# EAGLE design bike-computer (EAGLE 9.5.2)
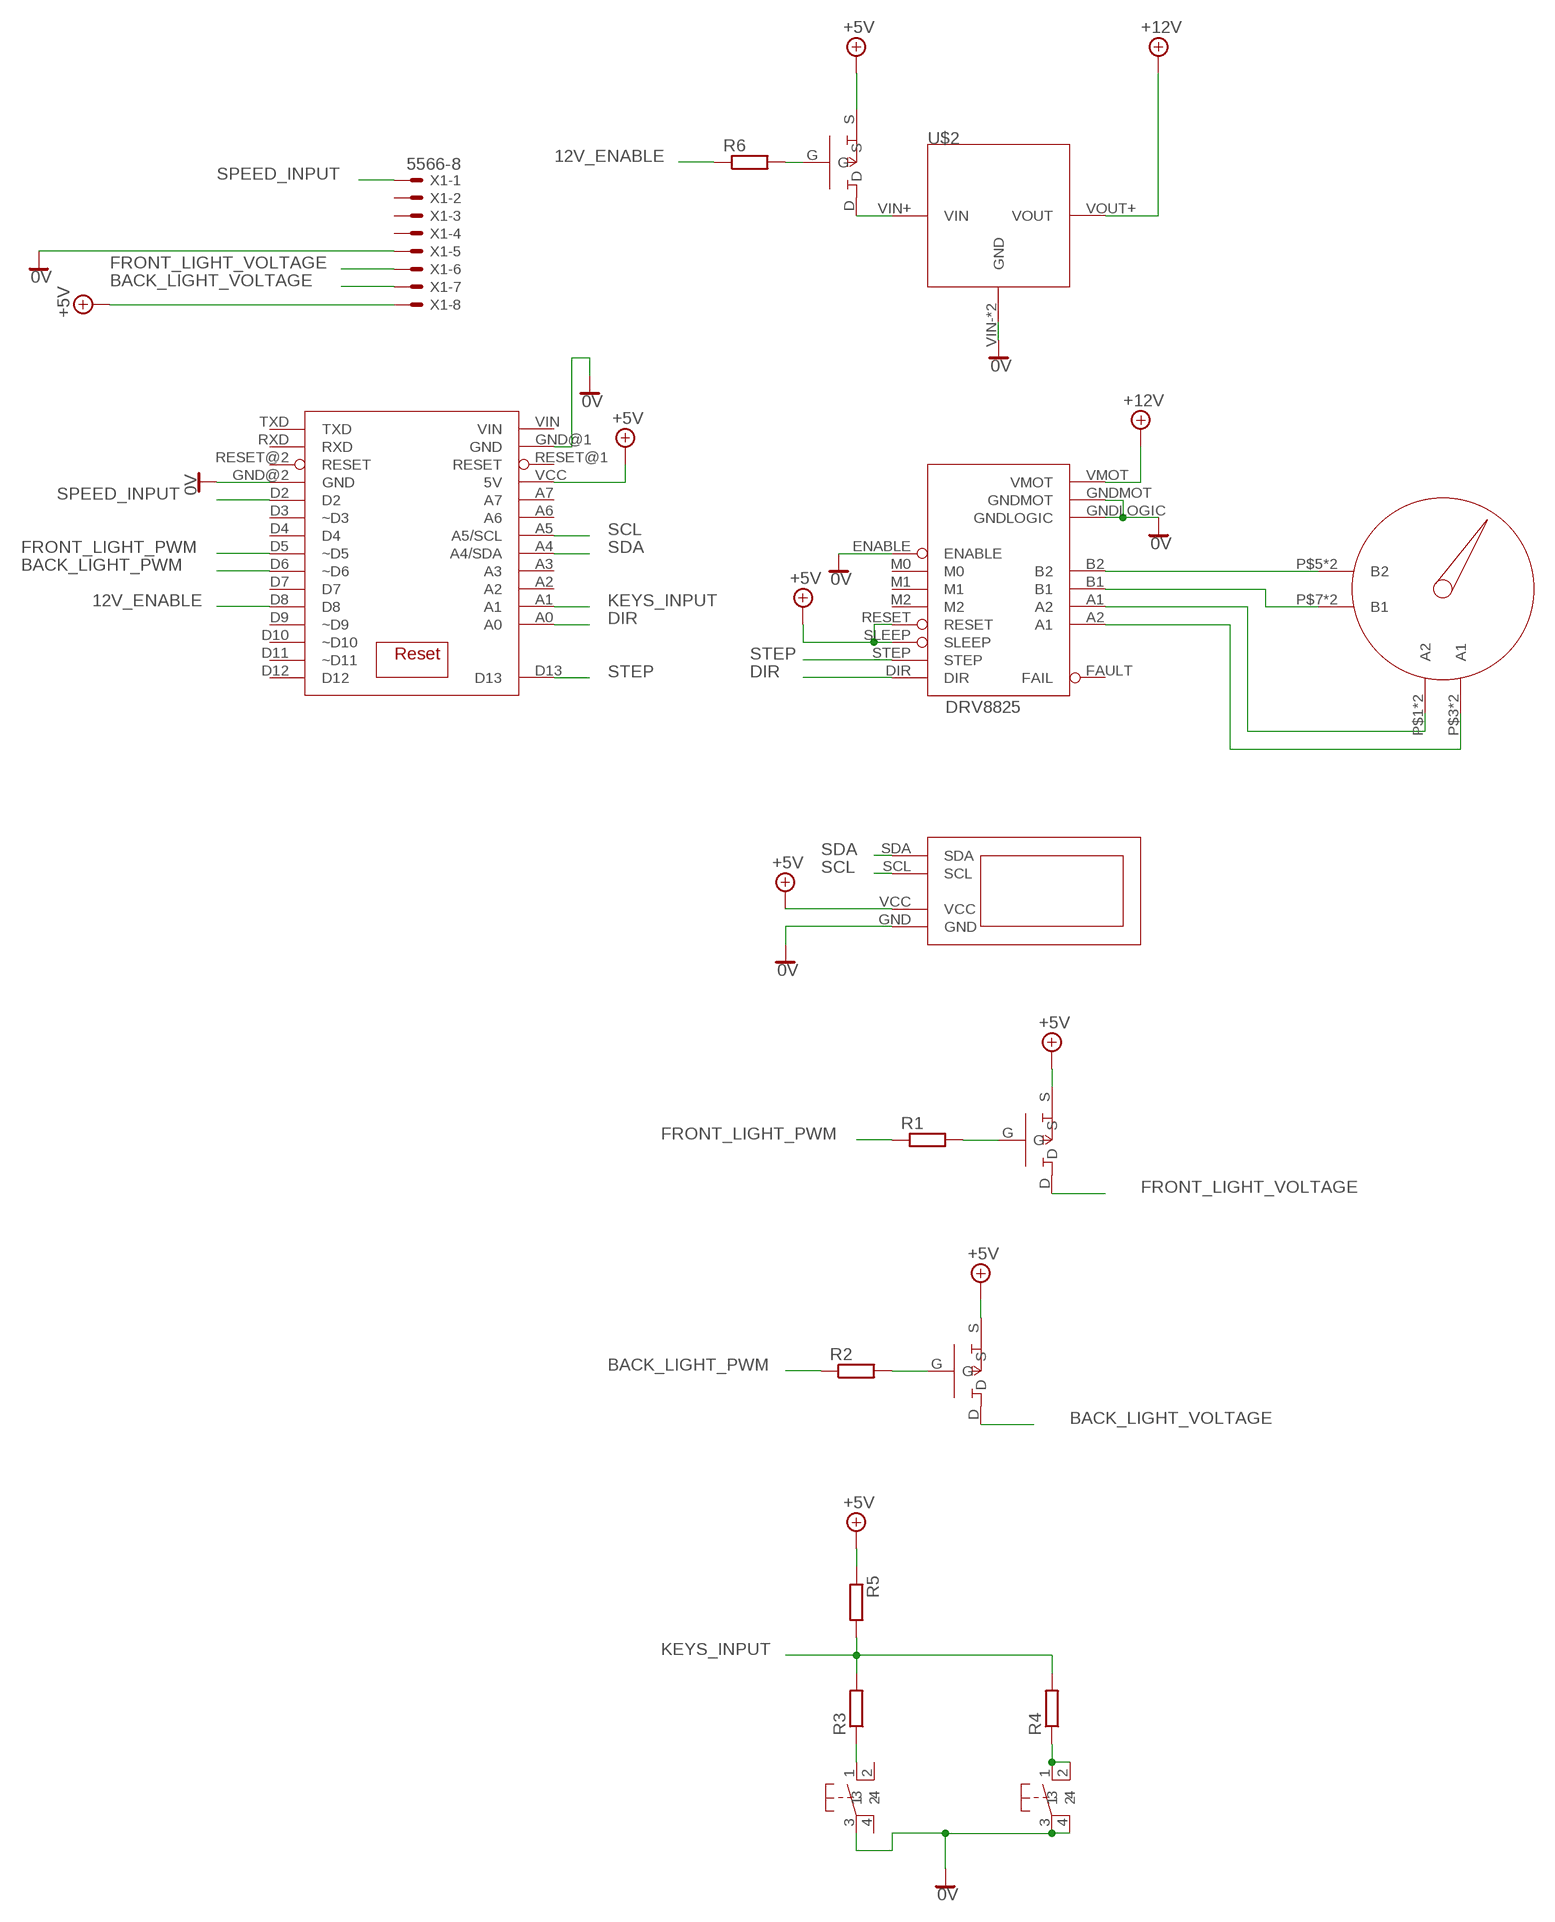
[diagram p0: schematic, sheet 1]

## Parts
DRV8825  DRV8825_BOARD  [DRV8255_BOARD]
R1  R-EU_0617/17  [0617/17]
R2  R-EU_0207/15  [0207/15]
R3  R-EU_0207/12  [0207/12]
R4  R-EU_0204/5  [0204/5]
R5  R-EU_0204/5  [0204/5]
R6  R-EU_0207/15  [0207/15]
U$1  STEPPER_GAUGE  [STEPPER_GAUGE]
U$2  STEP_UP_REG  [STEP_UP_REG]
U$3  OLED_0.9  [OLED_0.9]
U$4  BS250  [TO92(2.54)]
U$5  BS250  [TO92(2.54)]
U$6  BS250  [TO92(2.54)]
U$7  ARDUINO_PRO_MINI  [ARDUINO_PRO_MINI]
U$8  MICRO_SWITCH  [MICRO_SWITCH]
U$9  MICRO_SWITCH  [MICRO_SWITCH]
X1  5566-8  [5566-8]

## Nets
0V: DRV8825.ENABLE DRV8825.GNDLOGIC DRV8825.GNDMOT U$2.VIN-(GND) U$2.VOUT-(GND) U$3.GND U$7.GND@1(GND) U$7.GND@2(GND) U$8.3 U$9.3 U$9.4 X1.5
12V_ENABLE: R6.1 U$7.D8
+5V: DRV8825.RESET DRV8825.SLEEP R5.1 U$3.VCC U$4.S U$5.S U$6.S U$7.VCC(5V) X1.8
+12V: DRV8825.VMOT U$2.VOUT+(VOUT)
BACK_LIGHT_PWM: R2.1 U$7.D6(~D6)
BACK_LIGHT_VOLTAGE: U$5.D X1.7
DIR: DRV8825.DIR U$7.A0
FRONT_LIGHT_PWM: R1.1 U$7.D5(~D5)
FRONT_LIGHT_VOLTAGE: U$4.D X1.6
KEYS_INPUT: R3.2 R4.2 R5.2 U$7.A1
N$1: DRV8825.B2 U$1.P$5(B2) U$1.P$6(B2)
N$2: DRV8825.B1 U$1.P$7(B1) U$1.P$8(B1)
N$3: DRV8825.A1(A2) U$1.P$1(A2) U$1.P$2(A2)
N$4: DRV8825.A2(A1) U$1.P$3(A1) U$1.P$4(A1)
N$5: R1.2 U$4.G
N$6: R6.2 U$6.G
N$7: U$2.VIN+(VIN) U$6.D
N$8: R2.2 U$5.G
N$10: R3.1 U$8.1
N$11: R4.1 U$9.1 U$9.2
SCL: U$3.SCL U$7.A5(A5/SCL)
SDA: U$3.SDA U$7.A4(A4/SDA)
SPEED_INPUT: U$7.D2 X1.1
STEP: DRV8825.STEP U$7.D13
Unconnected: DRV8825.FAULT(FAIL) DRV8825.M0 DRV8825.M1 DRV8825.M2 U$7.A2 U$7.A3 U$7.A6 U$7.A7 U$7.D3(~D3) U$7.D4 U$7.D7 U$7.D9(~D9) U$7.D10(~D10) U$7.D11(~D11) U$7.D12 U$7.RESET@1(RESET) U$7.RESET@2(RESET) U$7.RXD U$7.TXD U$7.VIN U$8.2 U$8.4 X1.2 X1.3 X1.4

## Library data of the parts
DRV8825 = bike_computer:DRV8825_BOARD
R1-R6 = rcl:R-EU_: RESISTOR, European symbol; SPICEPREFIX: R
U$1 = bike_computer:STEPPER_GAUGE
U$2 = bike_computer:STEP_UP_REG
U$3 = bike_computer:OLED_0.9
U$4-U$6 = bike_computer:BS250
U$7 = bike_computer:ARDUINO_PRO_MINI
U$8 U$9 = bike_computer:MICRO_SWITCH
X1 = con-molex:5566-8: Mini FIT connector 8 pol Source: http://www.molex.com; MF: MOLEX; OC_FARNELL: unknown; OC_NEWARK: unknown

## Board
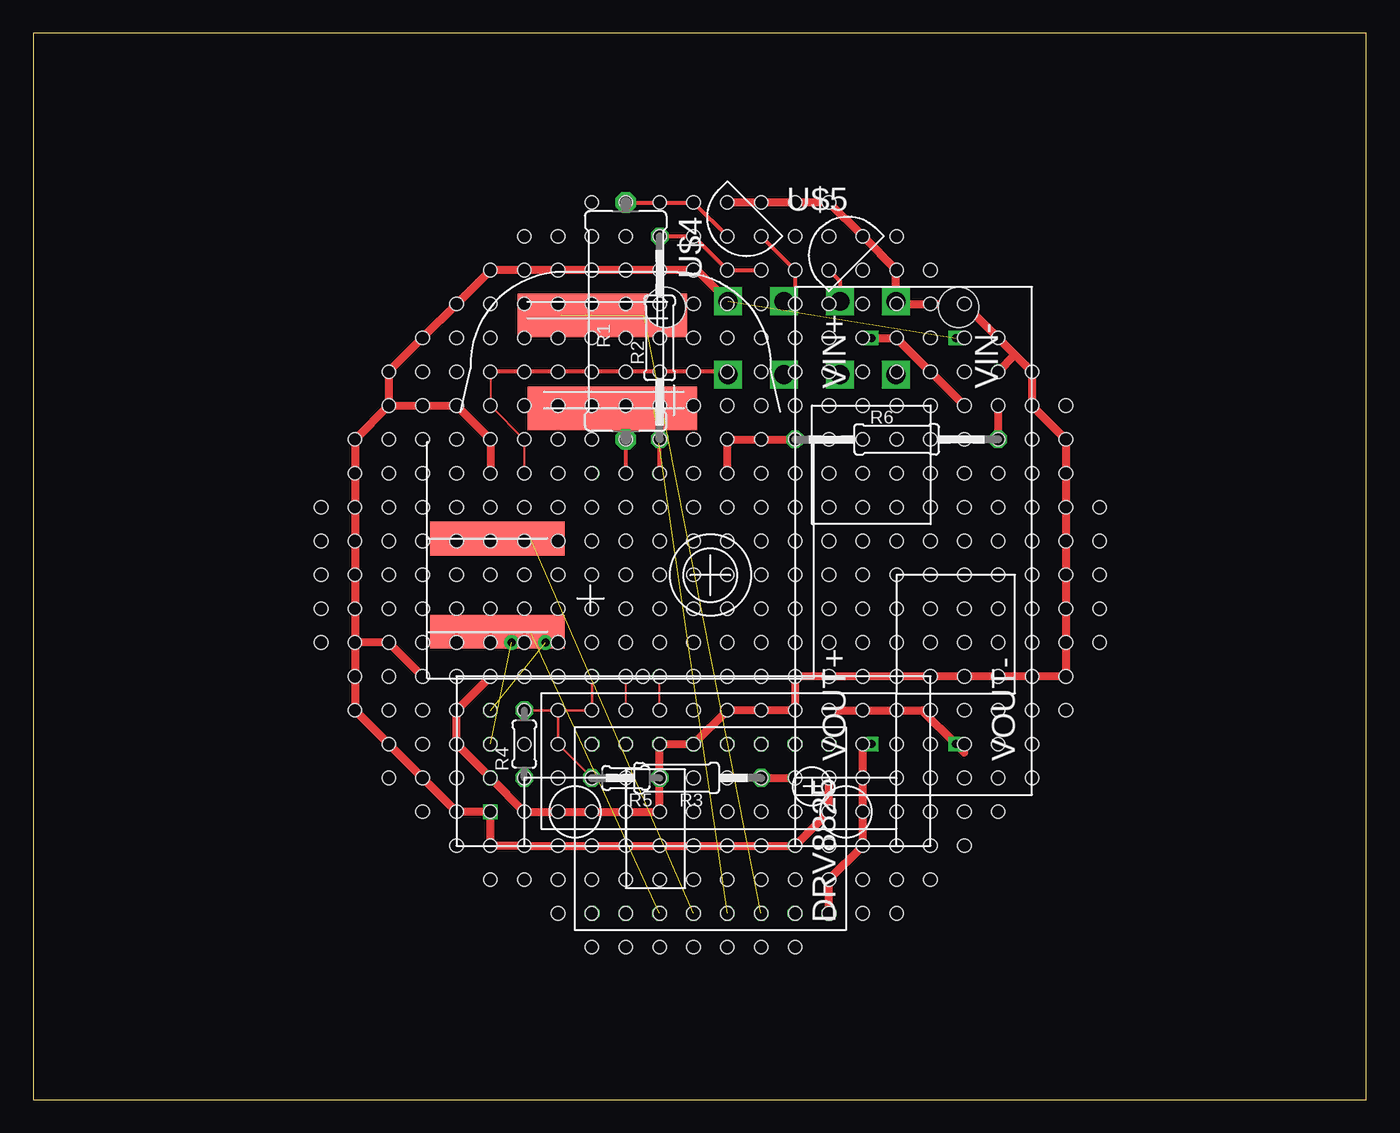
[diagram p1: board, top side]
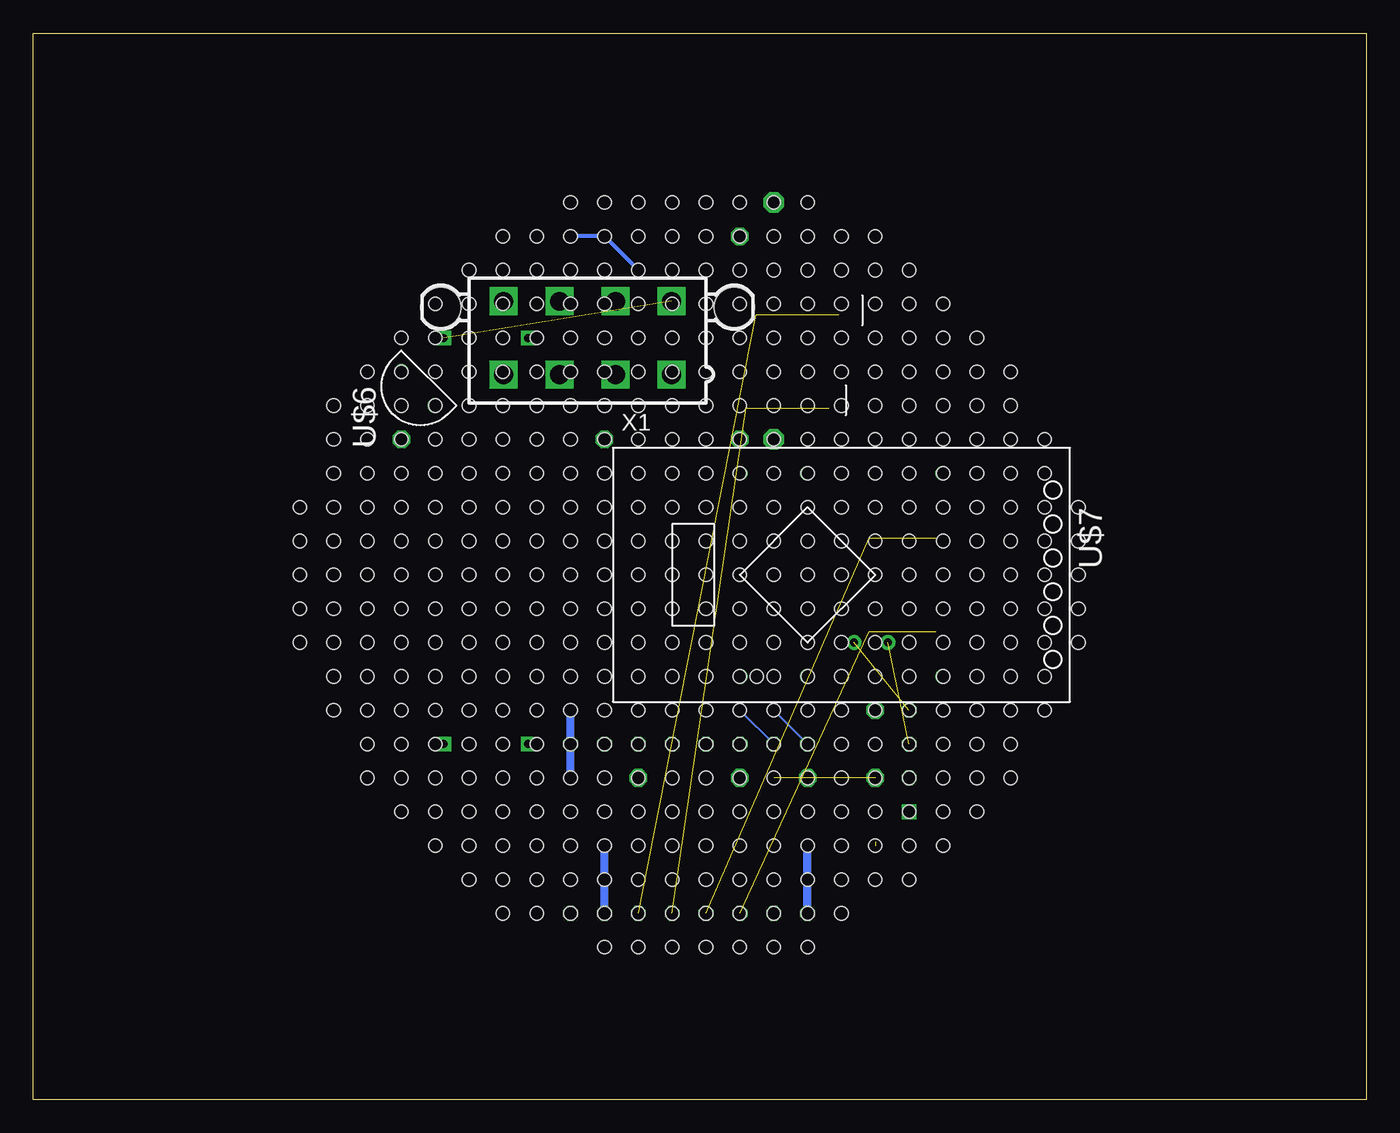
[diagram p2: board, bottom side, seen from below]

Size 100 x 80 mm. Coordinates in mm from the lower left corner, seen from the top.
Outline: 0,0 100,0 100,80 0,80 0,0
Copper layers (1*16): Top 0.035mm / dielectric 1.5mm / Bottom 0.035mm
Design rules "default": minimum track width 6mil, minimum drill 0.35mm, track to track 6mil, track to pad 6mil, pad to pad 6mil, via to via 6mil, smd to smd 6mil, copper to edge 40mil, drill to drill 6mil, minimum pad ring 10mil, minimum via ring 8mil, stop-mask expansion 4mil, vias tented up to drill 0mil, thermal gap 10mil
Holes 1 mm at 52.07,39.37 54.61,39.37 57.15,39.37 59.69,39.37 62.23,39.37 64.77,39.37 67.31,39.37 49.53,39.37 46.99,39.37 69.85,39.37 72.39,39.37 74.93,39.37 77.47,39.37 80.01,39.37 44.45,39.37 41.91,39.37 39.37,39.37 36.83,39.37 34.29,39.37 31.75,39.37 29.21,39.37 26.67,39.37 24.13,39.37 21.59,39.37 52.07,41.91 54.61,41.91 57.15,41.91 59.69,41.91 62.23,41.91 64.77,41.91 67.31,41.91 69.85,41.91 72.39,41.91 74.93,41.91 77.47,41.91 80.01,41.91 49.53,41.91 46.99,41.91 44.45,41.91 41.91,41.91 39.37,41.91 36.83,41.91 34.29,41.91 31.75,41.91 29.21,41.91 26.67,41.91 24.13,41.91 21.59,41.91 21.59,36.83 24.13,36.83 26.67,36.83 29.21,36.83 31.75,36.83 34.29,36.83 36.83,36.83 39.37,36.83 41.91,36.83 44.45,36.83 46.99,36.83 49.53,36.83 52.07,36.83 54.61,36.83 57.15,36.83 59.69,36.83 62.23,36.83 64.77,36.83 67.31,36.83 69.85,36.83 72.39,36.83 74.93,36.83 77.47,36.83 80.01,36.83 52.07,44.45 52.07,46.99 52.07,49.53 52.07,52.07 52.07,54.61 54.61,44.45 57.15,44.45 59.69,44.45 62.23,44.45 64.77,44.45 67.31,44.45 69.85,44.45 72.39,44.45 74.93,44.45 77.47,44.45 80.01,44.45 77.47,46.99 74.93,46.99 72.39,46.99 69.85,46.99 67.31,46.99 64.77,46.99 62.23,46.99 59.69,46.99 57.15,46.99 54.61,46.99 54.61,49.53 57.15,49.53 59.69,49.53 62.23,49.53 64.77,49.53 67.31,49.53 69.85,49.53 72.39,49.53 74.93,49.53 77.47,49.53 77.47,52.07 74.93,52.07 72.39,52.07 69.85,52.07 67.31,52.07 64.77,52.07 62.23,52.07 59.69,52.07 57.15,52.07 54.61,52.07 54.61,54.61 57.15,54.61 59.69,54.61 62.23,54.61 64.77,54.61 67.31,54.61 69.85,54.61 72.39,54.61 74.93,54.61 72.39,57.15 69.85,57.15 67.31,57.15 64.77,57.15 62.23,57.15 59.69,57.15 57.15,57.15 54.61,57.15 52.07,57.15 52.07,59.69 54.61,59.69 57.15,59.69 59.69,59.69 62.23,59.69 64.77,59.69 67.31,59.69 69.85,59.69 52.07,62.23 54.61,62.23 57.15,62.23 59.69,62.23 62.23,62.23 64.77,62.23 67.31,62.23 52.07,64.77 54.61,64.77 57.15,64.77 59.69,64.77 62.23,64.77 64.77,64.77 52.07,67.31 54.61,67.31 57.15,67.31 49.53,44.45 46.99,44.45 44.45,44.45 41.91,44.45 39.37,44.45 36.83,44.45 34.29,44.45 31.75,44.45 29.21,44.45 26.67,44.45 24.13,44.45 49.53,46.99 46.99,46.99 44.45,46.99 41.91,46.99 39.37,46.99 36.83,46.99 34.29,46.99 31.75,46.99 29.21,46.99 26.67,46.99 24.13,46.99 24.13,49.53 26.67,49.53 29.21,49.53 31.75,49.53 34.29,49.53 36.83,49.53 39.37,49.53 41.91,49.53 44.45,49.53 46.99,49.53 49.53,49.53 49.53,52.07 46.99,52.07 44.45,52.07 41.91,52.07 39.37,52.07 36.83,52.07 34.29,52.07 31.75,52.07 29.21,52.07 26.67,52.07 26.67,54.61 29.21,54.61 31.75,54.61 34.29,54.61 36.83,54.61 39.37,54.61 41.91,54.61 44.45,54.61 46.99,54.61 49.53,54.61 49.53,57.15 46.99,57.15 44.45,57.15 41.91,57.15 39.37,57.15 36.83,57.15 34.29,57.15 31.75,57.15 29.21,57.15 31.75,59.69 34.29,59.69 36.83,59.69 39.37,59.69 41.91,59.69 44.45,59.69 46.99,59.69 49.53,59.69 49.53,62.23 46.99,62.23 44.45,62.23 41.91,62.23 39.37,62.23 36.83,62.23 34.29,62.23 36.83,64.77 39.37,64.77 41.91,64.77 44.45,64.77 46.99,64.77 49.53,64.77 49.53,67.31 46.99,67.31 44.45,67.31 49.53,34.29 46.99,34.29 44.45,34.29 41.91,34.29 39.37,34.29 36.83,34.29 34.29,34.29 31.75,34.29 29.21,34.29 26.67,34.29 24.13,34.29 24.13,31.75 26.67,31.75 29.21,31.75 31.75,31.75 34.29,31.75 36.83,31.75 39.37,31.75 41.91,31.75 45.72,31.75 46.99,31.75 49.53,31.75 49.53,29.21 46.99,29.21 44.45,31.75 44.45,29.21 41.91,29.21 39.37,29.21 36.83,29.21 34.29,29.21 31.75,29.21 29.21,29.21 26.67,29.21 24.13,29.21 26.67,26.67 29.21,26.67 31.75,26.67 34.29,26.67 36.83,26.67 39.37,26.67 41.91,26.67 44.45,26.67 46.99,26.67 49.53,26.67 49.53,24.13 46.99,24.13 44.45,24.13 41.91,24.13 39.37,24.13 36.83,24.13 34.29,24.13 31.75,24.13 29.21,24.13 26.67,24.13 29.21,21.59 31.75,21.59 34.29,21.59 36.83,21.59 39.37,21.59 41.91,21.59 44.45,21.59 46.99,21.59 49.53,21.59 49.53,19.05 46.99,19.05 44.45,19.05 41.91,19.05 39.37,19.05 36.83,19.05 34.29,19.05 31.75,19.05 34.29,16.51 36.83,16.51 39.37,16.51 41.91,16.51 44.45,16.51 46.99,16.51 49.53,16.51 49.53,13.97 46.99,13.97 44.45,13.97 41.91,13.97 39.37,13.97 49.53,11.43 46.99,11.43 44.45,11.43 52.07,11.43 54.61,11.43 57.15,11.43 57.15,13.97 54.61,13.97 52.07,13.97 52.07,16.51 54.61,16.51 57.15,16.51 57.15,19.05 54.61,19.05 52.07,19.05 52.07,21.59 54.61,21.59 57.15,21.59 57.15,24.13 54.61,24.13 52.07,24.13 52.07,26.67 54.61,26.67 57.15,26.67 57.15,29.21 54.61,29.21 52.07,29.21 52.07,31.75 54.61,31.75 57.15,31.75 57.15,34.29 54.61,34.29 52.07,34.29 59.69,34.29 62.23,34.29 64.77,34.29 67.31,34.29 69.85,34.29 72.39,34.29 74.93,34.29 77.47,34.29 80.01,34.29 59.69,31.75 62.23,31.75 64.77,31.75 67.31,31.75 69.85,31.75 72.39,31.75 74.93,31.75 77.47,31.75 59.69,29.21 62.23,29.21 64.77,29.21 67.31,29.21 69.85,29.21 72.39,29.21 74.93,29.21 77.47,29.21 74.93,26.67 72.39,26.67 69.85,26.67 67.31,26.67 64.77,26.67 62.23,26.67 59.69,26.67 59.69,24.13 62.23,24.13 64.77,24.13 67.31,24.13 69.85,24.13 72.39,24.13 74.93,24.13 72.39,21.59 69.85,21.59 67.31,21.59 64.77,21.59 62.23,21.59 59.69,21.59 59.69,19.05 62.23,19.05 64.77,19.05 67.31,19.05 69.85,19.05 59.69,16.51 62.23,16.51 64.77,16.51 67.31,16.51 59.69,13.97 62.23,13.97 64.77,13.97 21.59,44.45 21.59,34.29 59.69,67.31 41.91,67.31 41.91,11.43

### Footprints (pad centres in the part's own frame; a part is rotated, then mirrored left to right if it is on the bottom)
DRV8255_BOARD = drill 0.6 octagon: A1 6.35,-1.27; A2 6.35,-3.81; B1 6.35,1.27; B2 6.35,3.81; DIR -6.35,-8.89; ENABLE -6.35,8.89; FAULT 6.35,-6.35; GNDLOGIC 6.35,-8.89; GNDMOT 6.35,6.35; M0 -6.35,6.35; M1 -6.35,3.81; M2 -6.35,1.27; RESET -6.35,-1.27; SLEEP -6.35,-3.81; STEP -6.35,-6.35; VMOT 6.35,8.89
0617/17 = drill 1.016 octagon: 1 -8.89,0; 2 8.89,0
0207/15 = drill 0.813 octagon: 1 -7.62,0; 2 7.62,0
0207/12 = drill 0.813 octagon: 1 -6.35,0; 2 6.35,0
0204/5 = drill 0.813 octagon: 1 -2.54,0; 2 2.54,0
STEPPER_GAUGE = smd 5.08 x 2.54: P$1 -11.75,-4.75; P$2 -6.75,-4.75; P$3 -11.75,-11.75; P$4 -6.75,-11.75 | smd 6.452 x 3.251: P$5 1.75,12; P$6 -4.5,12; P$7 2.5,5; P$8 -3.75,5
STEP_UP_REG = drill 0.6 square: VIN+ 15.24,3.175; VIN- 15.24,-3.175; VOUT+ -15.24,3.175; VOUT- -15.24,-3.175
OLED_0.9 = drill 0.6 square: GND -15.24,-3.81 | drill 0.6 octagon: SCL -15.24,1.27; SDA -15.24,3.81; VCC -15.24,-1.27
TO92(2.54) = drill 0.6: D 0,-2.54; G 0,0; S 2.54,0
ARDUINO_PRO_MINI = drill 0.6: A0 7.62,-5.08; A1 7.62,-2.54; A2 7.62,0; A3 7.62,2.54; A4 5.08,0.953; A5 5.08,3.493; A6 2.54,-15.24; A7 5.08,-15.24; D2 -7.62,2.54; D3 -7.62,0; D4 -7.62,-2.54; D5 -7.62,-5.08; D6 -7.62,-7.62; D7 -7.62,-10.16; D8 -7.62,-12.7; D9 -7.62,-15.24; D10 7.62,-15.24; D11 7.62,-12.7; D12 7.62,-10.16; D13 7.62,-7.62; GND@1 7.62,10.16; GND@2 -7.62,5.08; GND@3 0,-15.24; RESET@1 7.62,7.62; RESET@2 -7.62,7.62; RXD -7.62,10.16; TXD -7.62,12.7; VCC 7.62,5.08; VIN 7.62,12.7
MICRO_SWITCH = drill 0.6: 1 -2.54,2.54; 2 5.08,2.54; 3 -2.54,-2.54; 4 5.08,-2.54
5566-8 = drill 1.4 square: 1 6.3,-2.75; 2 2.1,-2.75; 3 -2.1,-2.75; 4 -6.3,-2.75; 5 6.3,2.75; 6 2.1,2.75; 7 -2.1,2.75; 8 -6.3,2.75 | hole 3: 11,2.29; -11,2.29

### Placement (x,y rotation side)
DRV8825  50.8,20.32 270 top
R1  44.45,58.42 90 top
R2  46.99,57.15 90 top
R3  48.26,24.13 180 top
R4  36.83,26.67 90 top
R5  44.45,24.13 180 top
R6  64.77,49.53 0 top
U$1  44.05,46.85 0 top
U$2  66.04,41.91 90 top
U$3  49.53,25.4 0 top
U$4  52.07,64.77 90 top
U$5  59.69,64.77 0 top
U$6  72.39,52.07 90 bottom
U$7  39.37,39.37 270 bottom
U$8  59.69,21.59 0 top
U$9  39.37,21.59 0 top
X1  58.42,57.15 0 bottom

### Tracks (layer width: path | path; a pad name or v marks a point on that pad's centre or on a via)
0V  (via drill 0.35)  (2 unrouted)
  Top 0.254: 36.83,19.33 36.55,19.33
  Top 0.61: X1.5 49.79,62.23 34.29,62.23 26.67,54.61 26.67,52.07 | 26.67,52.07 24.13,49.53 24.13,34.29 | 24.13,34.29 24.13,29.21 31.75,21.59 U$3.GND 34.29,19.05 U$9.3 v41.91,19.05 U$9.4 U$8.3 59.69,21.59 v59.69,24.13 | U$7.GND@1 26.67,34.29 24.13,34.29 | 69.85,26.04 U$2.VOUT- 66.67,29.21 v59.69,29.21 | 26.67,52.07 31.75,52.07 34.29,49.53 U$7.GND@2
  Bottom 0.61: v59.69,24.13 DRV8825.ENABLE v59.69,29.21 | DRV8825.GNDLOGIC v41.91,19.05 | DRV8825.GNDMOT U$8.3
12V_ENABLE
  Top 0.61: U$7.D8 52.07,49.53 R6.1
+5V  (via drill 0.35)
  Top 0.254: 64.72,62.18 64.77,62.23 | X1.8 64.93,59.69
  Top 0.61: X1.8 64.72,62.18 | 64.77,62.23 U$5.S 59.69,67.31 U$4.S | 64.93,59.69 69.85,59.69 73.66,55.88 | 73.66,55.88 74.93,54.61 74.93,52.07 77.47,49.53 77.47,31.75 57.15,31.75 57.15,29.21 52.07,29.21 DRV8825.RESET DRV8825.SLEEP R5.1 46.99,21.59 v36.83,21.59 U$3.VCC 31.75,26.67 31.75,29.21 U$7.VCC | U$6.S 73.66,55.88
+12V
  Top 0.61: DRV8825.VMOT 59.69,16.51 62.23,19.05 62.23,26.67 U$2.VOUT+
  Bottom 0.61: 62.23,26.67 U$2.VOUT+
BACK_LIGHT_PWM
  Top 0.305: U$7.D6 R2.1
BACK_LIGHT_VOLTAGE
  Top 0.305: U$5.D 60.52,61.4 X1.7
DIR  (via drill 0.35)
  Top 0.152: v44.45,29.21 U$7.A0
  Bottom 0.152: DRV8825.DIR v44.45,29.21
FRONT_LIGHT_PWM
  Top 0.305: U$7.D5 R1.1
FRONT_LIGHT_VOLTAGE
  Top 0.254: 57.15,60.73 X1.6
  Top 0.305: U$4.D 57.15,62.23 57.15,60.73
KEYS_INPUT
  Top 0.2: R4.2 39.37,29.21 | 39.37,29.21 41.91,29.21 U$7.A1 | R5.2 39.37,26.67 39.37,29.21
N$1  (2 unrouted)
N$2  (2 unrouted)
N$3  (2 unrouted)
N$4  (2 unrouted)
N$5
  Top 0.305: U$4.G 49.53,67.31 R1.2
N$6
  Top 0.61: R6.2 U$6.G
N$7
  Top 0.61: U$2.VIN+ 64.77,57.15 U$6.D
N$8  (via drill 0.35)
  Top 0.305: v54.61,62.23 52.07,62.23 49.53,64.77 R2.2
  Bottom 0.305: v54.61,62.23 57.15,64.77 U$5.G
N$10
  Top 0.61: R3.1 U$8.1
N$11  (1 unrouted)
SCL  (1 unrouted)
SDA  (1 unrouted)
SPEED_INPUT
  Top 0.152: 34.29,54.61 34.29,52.07 36.83,49.53 U$7.D2
  Top 0.305: 51.91,54.61 34.29,54.61
  Top 0.61: X1.1 51.91,54.61
STEP  (via drill 0.35)
  Top 0.152: v46.99,29.21 U$7.D13
  Bottom 0.152: DRV8825.STEP v46.99,29.21